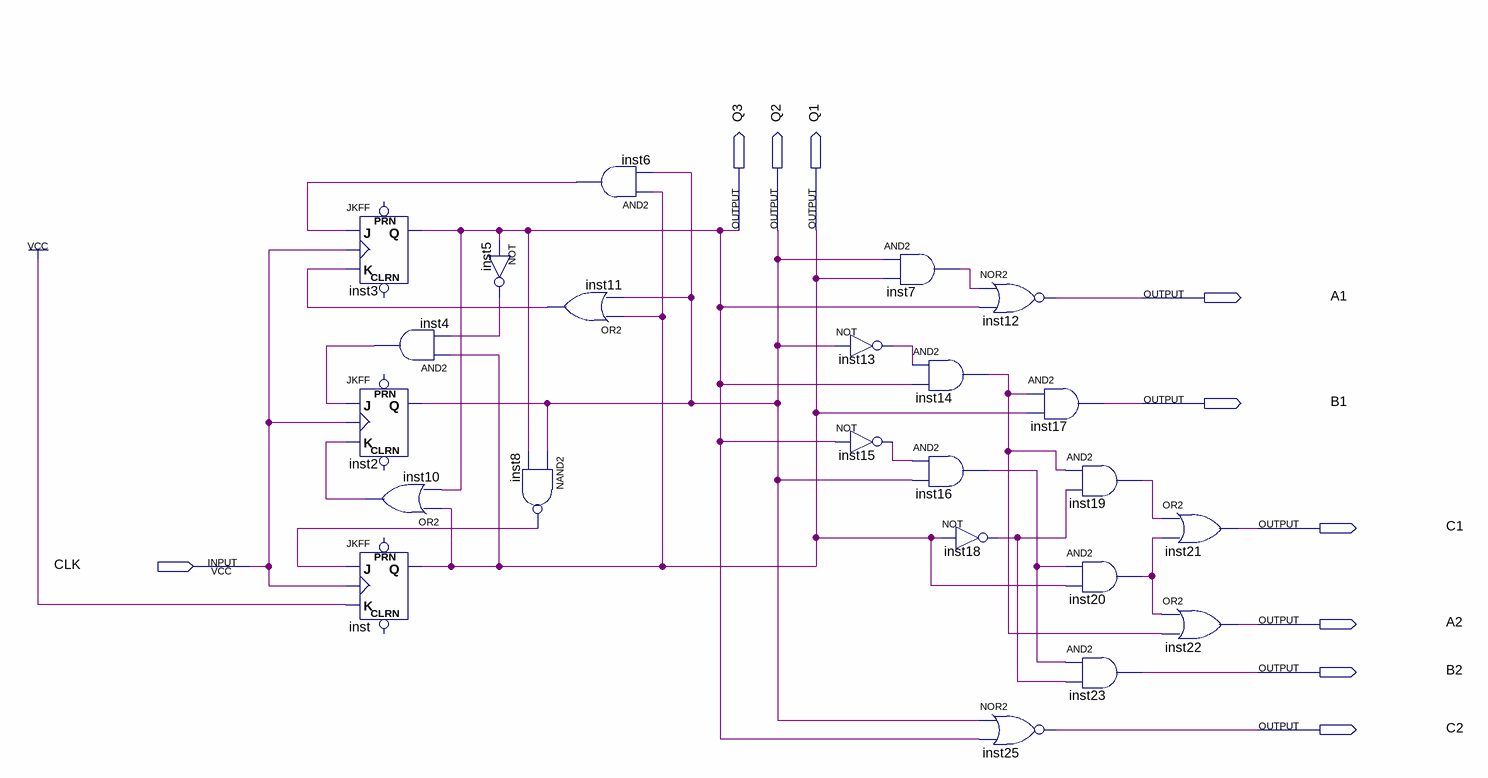
[diagram p0: schematic sheet]
// Quartus schematic project1.bdf as structural Verilog: 23 symbols, 10 pins
module project1 (
  input  CLK,
  output Q3,
  output Q2,
  output Q1,
  output A1,
  output B1,
  output C1,
  output A2,
  output B2,
  output C2
);

  wire inst4_out, inst5_out, inst6_out, inst7_out, inst8_out, inst10_out, inst11_out, inst13_out, inst14_out,
       inst15_out, inst16_out, inst18_out, inst19_out, inst20_out;

  JKFF inst3 (.K(inst11_out), .J(inst6_out), .CLK(CLK), .Q(Q3));  // open: PRN, CLRN
  and inst4 (inst4_out, Q1, inst5_out);
  JKFF inst2 (.K(inst10_out), .J(inst4_out), .CLK(CLK), .Q(Q2));  // open: PRN, CLRN
  or inst10 (inst10_out, Q1, Q3);
  JKFF inst (.K(1'b1), .J(inst8_out), .CLK(CLK), .Q(Q1));  // open: PRN, CLRN
  not inst5 (inst5_out, Q3);
  or inst11 (inst11_out, Q1, Q2);
  nand inst8 (inst8_out, Q2, Q3);
  and inst6 (inst6_out, Q1, Q2);
  not inst13 (inst13_out, Q2);
  not inst15 (inst15_out, Q3);
  and inst7 (inst7_out, Q2, Q1);
  and inst14 (inst14_out, inst13_out, Q3);
  and inst16 (inst16_out, inst15_out, Q2);
  not inst18 (inst18_out, Q1);
  nor inst12 (A1, inst7_out, Q3);
  and inst17 (B1, inst14_out, Q1);
  nor inst25 (C2, Q2, Q3);
  and inst19 (inst19_out, inst14_out, inst18_out);
  and inst20 (inst20_out, inst16_out, Q1);
  and inst23 (B2, inst16_out, inst18_out);
  or inst21 (C1, inst19_out, inst20_out);
  or inst22 (A2, inst20_out, inst14_out);
endmodule
